# EAGLE design Schemtatic (EAGLE 9.3.0)
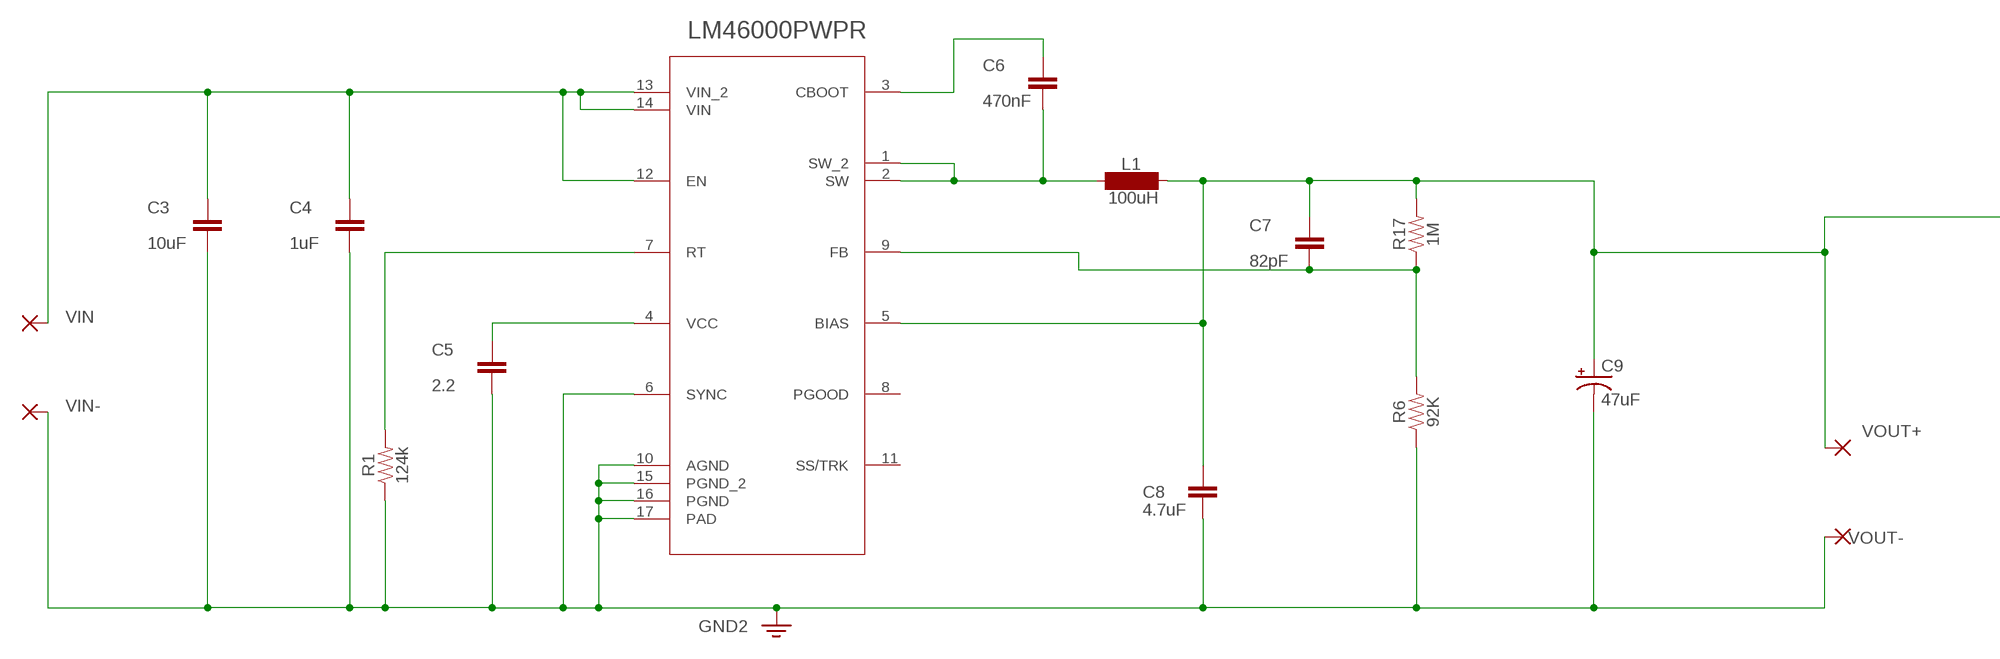
[diagram p0: schematic, sheet 1, part 1 of 2]
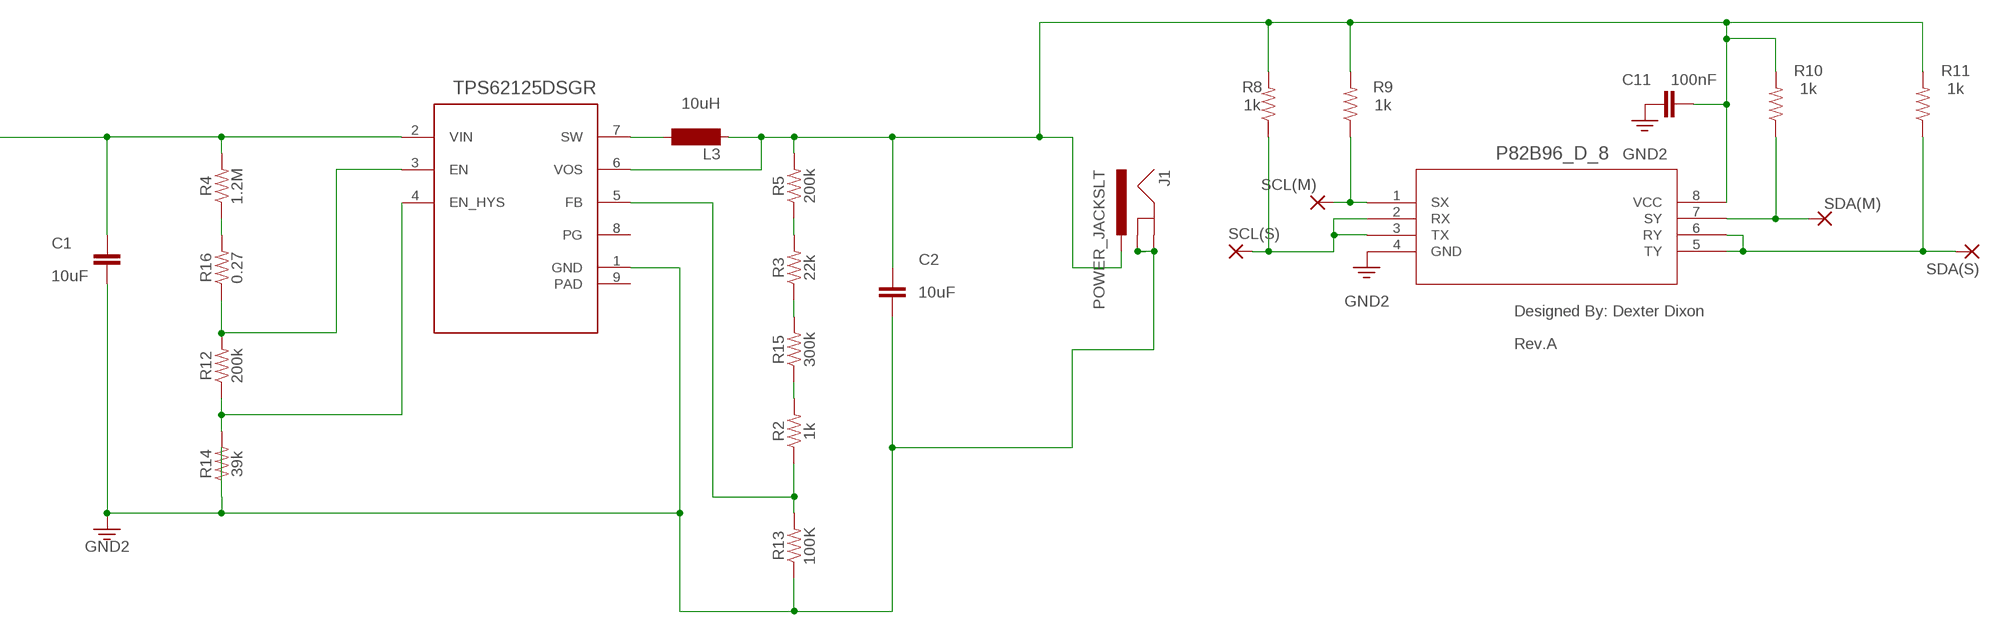
[diagram p1: schematic, sheet 1, part 2 of 2]

## Parts
C1  10uF  C2,5-3  [C2.5-3]
C2  10uF  C2,5-3  [C2.5-3]
C3  10uF  C2,5-3  [C2.5-3]
C4  1uF  C2,5-3  [C2.5-3]
C5  2.2  C2,5-3  [C2.5-3]
C6  470nF  C2,5-3  [C2.5-3]
C7  82pF  C2,5-3  [C2.5-3]
C8  4.7uF  C2,5-3  [C2.5-3]
C9  47uF  47UF-POLAR-EIA3528-10V-10%  [EIA3528]
C11  100nF  C2,5-3  [C2.5-3]
J1  POWER_JACKSLT  [POWER_JACK_SLOT]
L1  100uH  MS42  [MS42]
L3  10uH  MS42  [MS42]
R1  124k  100KOHM-0603-1/10W-1%  [0603]
R2  1k  1KOHM-0603-1/10W-1%  [0603]
R3  22k  22KOHM-0603-1/10W-1%  [0603]
R4  1.2M  1.2MOHM-0603-1/10W-1%  [0603]
R5  200k  200KOHM-0603-1/10W-1%  [0603]
R6  92K  100KOHM-0402-1/16W-1%  [0402]
R8  1k  1KOHM-0603-1/10W-1%  [0603]
R9  1k  1KOHM-0603-1/10W-1%  [0603]
R10  1k  1KOHM-0603-1/10W-1%  [0603]
R11  1k  1KOHM-0603-1/10W-1%  [0603]
R12  200k  200KOHM-0603-1/10W-1%  [0603]
R13  100K  100KOHM-0402-1/16W-1%  [0402]
R14  39k  39KOHM-0603-1/10W-1%  [0603]
R15  300k  300KOHM-0603-1/10W-1%  [0603]
R16  0.27  0.27OHM-0603-1/10W-1%  [0603]
R17  1M  1MOHM-0603-1/4W-5%  [0603]
SCL(M)  SMD5  [SMD2,54-5,08]
SCL(S)  SMD5  [SMD2,54-5,08]
SDA(M)  SMD5  [SMD2,54-5,08]
SDA(S)  SMD5  [SMD2,54-5,08]
TPS62125DSGR  Value  TPS62125DSGR  [DSG0008A]
U1  LM46000PWPR  [PWP0016F]
U2  P82B96_D_8  [D8]
VIN+  SMD5  [SMD2,54-5,08]
VIN-  SMD5  [SMD2,54-5,08]
VOUT+  SMD5  [SMD2,54-5,08]
VOUT-  SMD5  [SMD2,54-5,08]

## Nets
3.3V: C1.2 C2.2 C3.2 C4.2 C5.2 C8.2 C9.C(-) C11.1 J1.GND@1(GNDBREAK) J1.GND@2(GND) R1.1 R6.1 R13.1 R14.1 TPS62125DSGR.1(GND) U1.6(SYNC) U1.10(AGND) U1.15(PGND_2) U1.16(PGND) U1.17(PAD) U2.4(GND) VIN-.1(P) VOUT-.1(P) ; supply symbol labelled GND2
N$1: R8.1 SCL(S).1(P) U2.2(RX) U2.3(TX)
N$2: R11.1 SDA(S).1(P) U2.5(TY) U2.6(RY)
N$3: L3.2 TPS62125DSGR.7(SW)
N$4: R12.1 R14.2 TPS62125DSGR.4(EN_HYS)
N$5: R12.2 R16.1 TPS62125DSGR.3(EN)
N$6: C2.1 C11.2 J1.PWR L3.1 R5.2 R8.2 R9.2 R10.2 R11.2 TPS62125DSGR.6(VOS) U2.8(VCC)
N$7: C5.1 U1.4(VCC)
N$8: R3.2 R5.1
N$9: R4.1 R16.2
N$10: R9.1 SCL(M).1(P) U2.1(SX)
N$11: R10.1 SDA(M).1(P) U2.7(SY)
N$12: C6.2 L1.2 U1.1(SW_2) U1.2(SW)
N$13: C6.1 U1.3(CBOOT)
N$14: C7.2 R6.2 R17.1 U1.9(FB)
N$15: R2.1 R13.2 TPS62125DSGR.5(FB)
N$16: C1.1 C7.1 C8.1 C9.A(+) L1.1 R4.2 R17.2 TPS62125DSGR.2(VIN) U1.5(BIAS) VOUT+.1(P)
N$17: R3.1 R15.2
N$18: R2.2 R15.1
N$19: R1.2 U1.7(RT)
VIN+: C3.1 C4.1 U1.12(EN) U1.13(VIN_2) U1.14(VIN) VIN+.1(P)
Unconnected: TPS62125DSGR.8(PG) U1.8(PGOOD) U1.11(SS/TRK)

## Notes on the sheet
- Designed By: Dexter Dixon
- Rev.A

## Power pins joined to a net without a drawn wire
PAD: TPS62125DSGR.9(PAD)

## Library data of the parts
C1-C8 C11 = capacitor-wima:C: CAPACITOR naming: grid - package width
C9 = SparkFun-Capacitors:47UF-POLAR: 47µF polarized capacitors A capacitor is a passive two-terminal electrical component used to store electrical energy temporarily in an electric field.; PROD_ID: CAP-08310
J1 = SparkFun-Connectors:POWER_JACK: Power Jack Connector This is the standard 5.5mm barrel jack for power. The PTH is the most common, proven, reliable, footprint. The Slot footprint only works if the mill layer is transmitted to the PCB fab house so be warned. Here are the connectors we sell at SparkFun: DC Barrel Power Jack/Connector <https://www.sparkfun.com/products/119> (PRT-00119) DC Barrel Power Jack/Connector (SMD) <https://www.sparkfun.com/products/12748> (PRT-12748) DC Barrel Jack Adapter - Breadboard Compatible <https://www.sparkfun.com/products/10811> (PRT-10811) It is used on this SparkFun product (and many, many others): SparkFun RedBoard - Programmed with Arduino <https://www.sparkfun.com/products/12757> (DEV-12757) Also, if you need a mating power supply or connector, please check these out: Wall Adapter Power Supply - 9VDC 650mA <https://www.sparkfun.com/products/298> (TOL-00298) DC Barrel Jack Adapter - Male <https://www.sparkfun.com/products/10287> (PRT-10287); PROD_ID: PRT-00119
L1 = inductor-neosid:MS42: INDUCTOR SMD inductor; L: 100uH; OC_FARNELL: unknown; OC_NEWARK: unknown
L3 = inductor-neosid:MS42: INDUCTOR SMD inductor; L: 10uH; OC_FARNELL: unknown; OC_NEWARK: unknown
R1 = SparkFun-Resistors:100KOHM: 100kΩ resistor A resistor is a passive two-terminal electrical component that implements electrical resistance as a circuit element. Resistors act to reduce current flow, and, at the same time, act to lower voltage levels within circuits. - Wikipedia; PROD_ID: RES-07828; VALUE: 100k
R2 R8-R11 = SparkFun-Resistors:1KOHM: 1kΩ resistor A resistor is a passive two-terminal electrical component that implements electrical resistance as a circuit element. Resistors act to reduce current flow, and, at the same time, act to lower voltage levels within circuits. - Wikipedia; PROD_ID: RES-07856
R3 = SparkFun-Resistors:22KOHM: 22kΩ resistor A resistor is a passive two-terminal electrical component that implements electrical resistance as a circuit element. Resistors act to reduce current flow, and, at the same time, act to lower voltage levels within circuits. - Wikipedia; PROD_ID: RES-07853
R4 = SparkFun-Resistors:1.2MOHM: 1.2MΩ resistor A resistor is a passive two-terminal electrical component that implements electrical resistance as a circuit element. Resistors act to reduce current flow, and, at the same time, act to lower voltage levels within circuits. - Wikipedia; PROD_ID: RES-10055
R5 R12 = SparkFun-Resistors:200KOHM: 200kΩ resistor A resistor is a passive two-terminal electrical component that implements electrical resistance as a circuit element. Resistors act to reduce current flow, and, at the same time, act to lower voltage levels within circuits. - Wikipedia; PROD_ID: RES-09385
R6 = SparkFun-Resistors:100KOHM: 100kΩ resistor A resistor is a passive two-terminal electrical component that implements electrical resistance as a circuit element. Resistors act to reduce current flow, and, at the same time, act to lower voltage levels within circuits. - Wikipedia; PROD_ID: RES-13495; VALUE: 100K
R13 = SparkFun-Resistors:100KOHM: 100kΩ resistor A resistor is a passive two-terminal electrical component that implements electrical resistance as a circuit element. Resistors act to reduce current flow, and, at the same time, act to lower voltage levels within circuits. - Wikipedia; PROD_ID: RES-13495
R14 = SparkFun-Resistors:39KOHM: 39kΩ resistor A resistor is a passive two-terminal electrical component that implements electrical resistance as a circuit element. Resistors act to reduce current flow, and, at the same time, act to lower voltage levels within circuits. - Wikipedia; PROD_ID: RES-12377
R15 = SparkFun-Resistors:300KOHM: 300kΩ resistor A resistor is a passive two-terminal electrical component that implements electrical resistance as a circuit element. Resistors act to reduce current flow, and, at the same time, act to lower voltage levels within circuits. - Wikipedia; PROD_ID: RES-10809
R16 = SparkFun-Resistors:0.27OHM: 0.27Ω resistor A resistor is a passive two-terminal electrical component that implements electrical resistance as a circuit element. Resistors act to reduce current flow, and, at the same time, act to lower voltage levels within circuits. - Wikipedia; PROD_ID: RES-08787
R17 = SparkFun-Resistors:1MOHM: 1MΩ resistor A resistor is a passive two-terminal electrical component that implements electrical resistance as a circuit element. Resistors act to reduce current flow, and, at the same time, act to lower voltage levels within circuits. - Wikipedia; PROD_ID: RES-07868
SCL(M) SCL(S) SDA(M) SDA(S) VOUT+ VOUT- = wirepad:SMD5: SMD PAD
TPS62125DSGR = TPS62125:TPS62125DSGR; ALTERNATEPARTNUMBER: TPS62125DSGT; COMPTYPE: IC; MANUFACTURER: Texas Instruments; MOUNTTYPE: SMT; PACKAGEREFERENCE: DSG0008A; PARTNUMBER: TPS62125DSGR; PIN_COUNT: 9; REFDES: RefDes; ROHS: Y; TYPE: TYPE
U1 = LM46000:LM46000PWPR; ADDRESS1: Not shown in title block; ADDRESS2: Not shown in title block; ADDRESS3: Not shown in title block; ADDRESS4: Not shown in title block; ALTERNATEMANUFACTURER: None; APPROVEDBY: Not shown in title block; AUTHOR: Not shown in title block; CHECKEDBY: Not shown in title block; COMPANYNAME: Not shown in title block; COMPONENTLINK1DESCRIPTION: Datasheet Link; COMPONENTLINK1URL: NA; COMPTYPE: IC; CURRENTDATE: Not shown in title block; CURRENTTIME: Not shown in title block; DATE: Not shown in title block; DESIGNATOR: U?; DOCUMENTFULLPATHANDNAME: Not shown in title block; DOCUMENTNAME: Not shown in title block; DOCUMENTNUMBER: 1; ENGINEER: Not shown in title block; IMAGEPATH: Not shown in title block; LATESTREVISIONDATE: 20140220; MANUFACTURER: Texas Instruments; MODIFIEDDATE: Not shown in title block; MOUNTTYPE: SMT; ORGANIZATION: Not shown in title block; PACKAGEREFERENCE: PWP0016F; PARTNUMBER: LM46000PWP; PIN_COUNT: 17; PROJECTNAME: *; PUBLISHER: Texas Instruments; REVISION: Use project parameter SCH_Rev; ROHS: Y; RULE: *; SHEETNUMBER: 1; SHEETTOTAL: 1; SYMBOLCREATOR: x0208326; SYMBOLVERSION: 20140214; TIME: Not shown in title block; UM: EA
U2 = BusBuffer:P82B96_D_8; DATASHEETURL: httpwww.ti.comlitgpnP82B96; FAMILY_NAME: I2C HUB BUFFER REPEATER; GENERIC_PART_NUMBER: P82B96; INDUSTRY_STD_PKG_TYPE: SOIC; MANUFACTURER: Texas Instruments; MANUFACTURER_PART_NUMBER: p82b96_d_8; PACKAGE_DESIGNATOR: D; PIN_COUNT: 8; VENDOR: Texas Instruments
VIN+ = wirepad:SMD5: SMD PAD; VIN: 48V
VIN- = wirepad:SMD5: SMD PAD; VIN-: GND

## Net classes
0 default: width 0.152 mm, clearance 0.203 mm

## Board
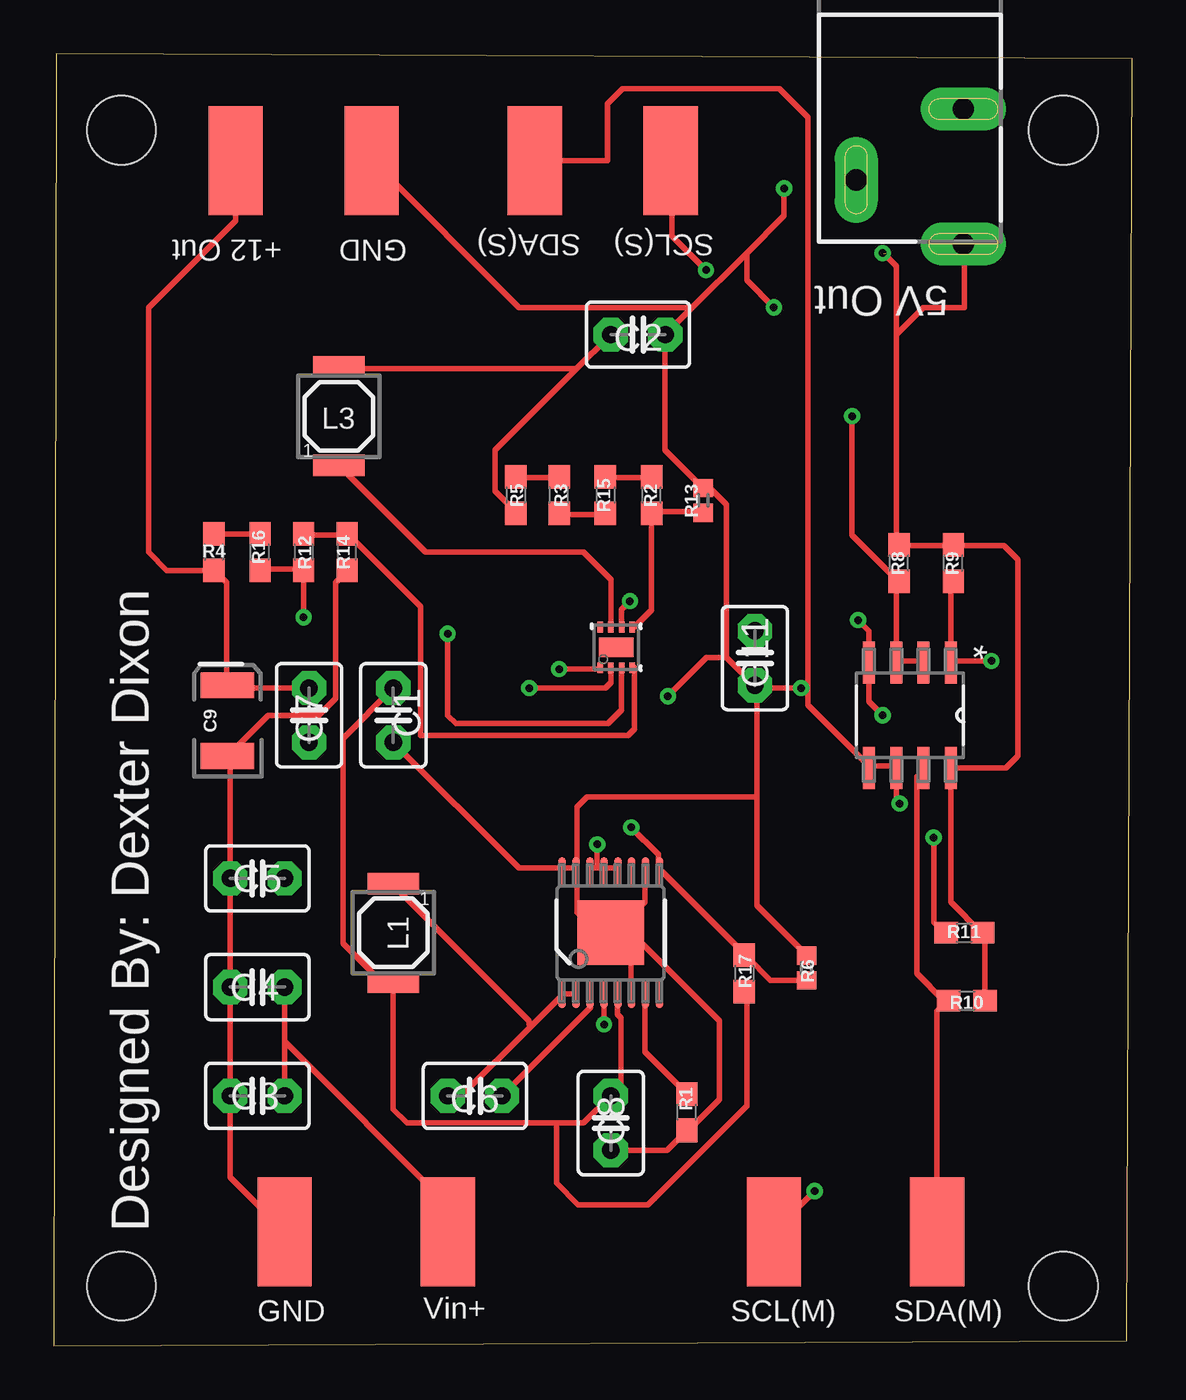
[diagram p2: board, top side]
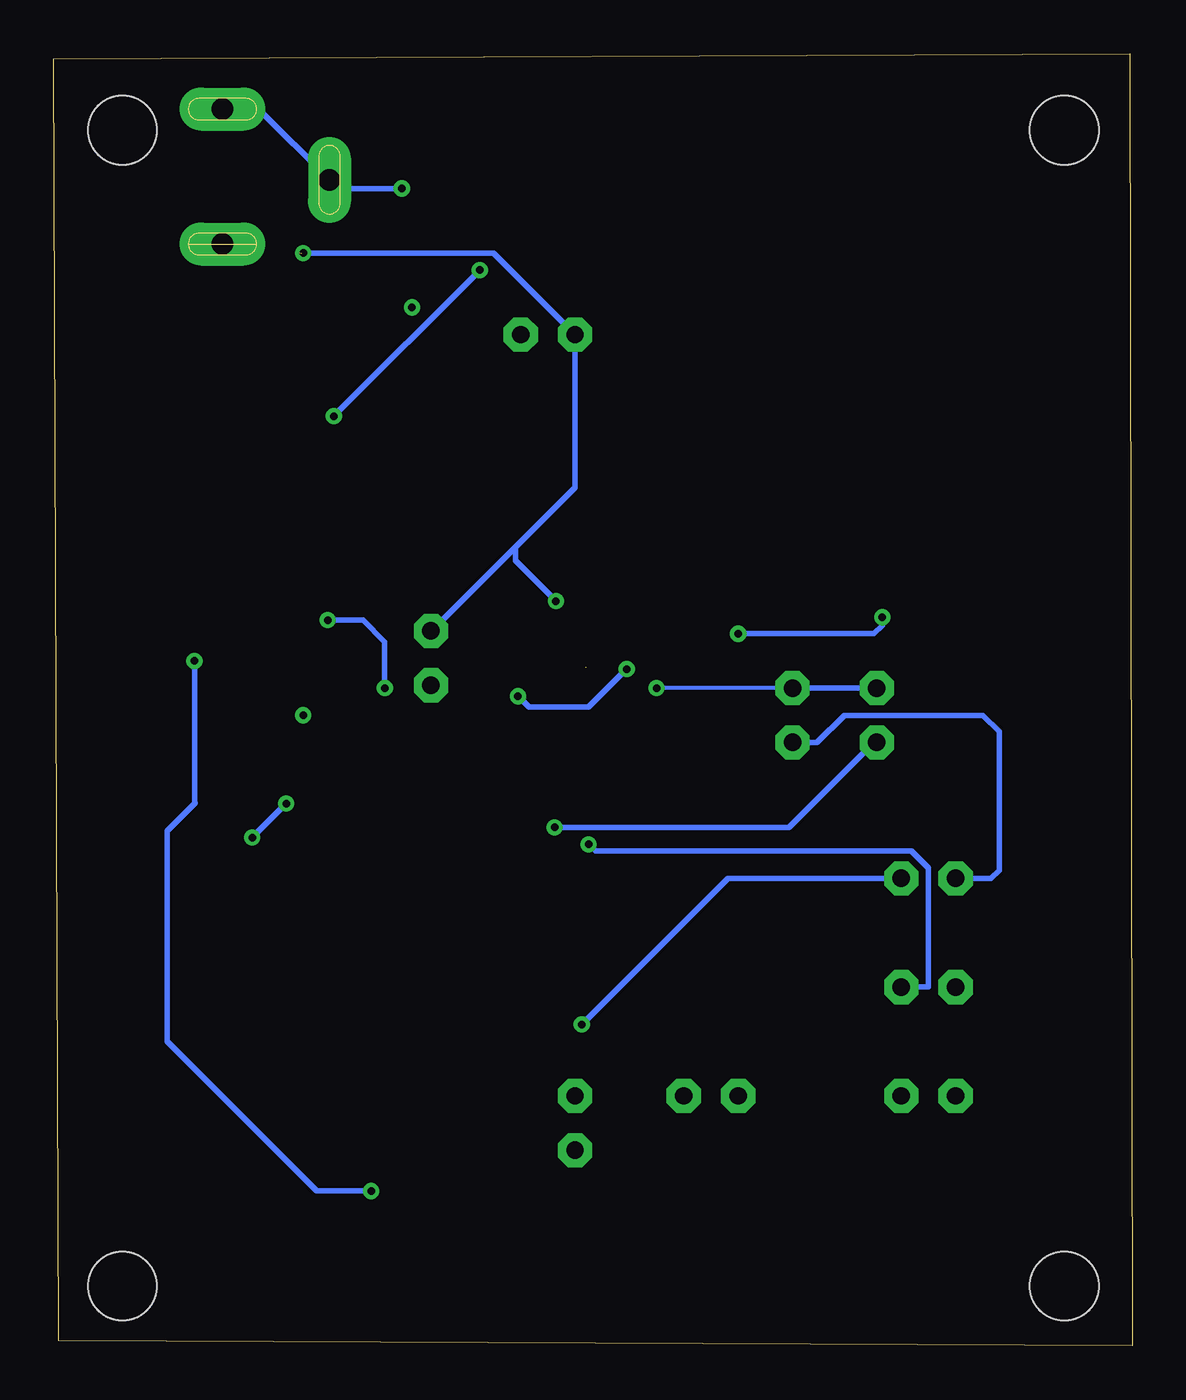
[diagram p3: board, bottom side, seen from below]

Size 50.4 x 60.38 mm. Coordinates in mm from the lower left corner, seen from the top.
Outline: 0,0 50.14,0.25 50.4,60.12 0.13,60.38 0,0
Copper layers (1*16): Top 0.035mm / dielectric 1.5mm / Bottom 0.035mm
Design rules "default *": minimum track width 7mil, minimum drill 0.35mm, track to track 10mil, track to pad 10mil, pad to pad 10mil, via to via 10mil, smd to smd 6mil, copper to edge 40mil, drill to drill 6mil, minimum pad ring 10mil, minimum via ring 8mil, stop-mask expansion 4mil, vias tented up to drill 0mil, thermal gap 10mil
Holes 3.2 mm at 3.17,56.79 3.17,2.79 47.17,2.79 47.17,56.79

### Footprints (pad centres in the part's own frame; a part is rotated, then mirrored left to right if it is on the bottom)
C2.5-3 = drill 0.813 pad 1.6 octagon: 1 -1.27,0; 2 1.27,0
EIA3528 = smd 1.2 x 2.5: A 1.65,0; C -1.65,0
POWER_JACK_SLOT = drill 1 pad 2 long: GND@1 2.58,7.5; GND@2 7.58,10.8; PWR 2.58,13.8
MS42 = smd 2.4 x 1: 1 0,2.3; 2 0,-2.3
0603 = smd 1.1 x 1: 1 -0.85,0; 2 0.85,0
0402 = smd 0.85 x 0.9: 1 -0.58,0; 2 0.58,0
SMD2,54-5,08 = smd 2.54 x 5.08: 1 0,0
DSG0008A = smd 0.5 x 0.25: 1 -0.95,0.75; 2 -0.95,0.25; 3 -0.95,-0.25; 4 -0.95,-0.75; 5 0.95,-0.75; 6 0.95,-0.25; 7 0.95,0.25; 8 0.95,0.75 | smd 0.9 x 1.6: 9 0,0 | smd 0.5 x 0.5: V 0,-0.4
PWP0016F = smd 1.3 x 0.35: 1 -2.875,2.275; 2 -2.875,1.625; 3 -2.875,0.975; 4 -2.875,0.325; 5 -2.875,-0.325; 6 -2.875,-0.975; 7 -2.875,-1.625; 8 -2.875,-2.275; 9 2.875,-2.275; 10 2.875,-1.625; 11 2.875,-0.975; 12 2.875,-0.325; 13 2.875,0.325; 14 2.875,0.975; 15 2.875,1.625; 16 2.875,2.275 | smd 3 x 3.1: 17 0,0 | smd 0.4 x 0.4: V -1,0
D8 = smd 1.981 x 0.559: 1 -2.464,1.905; 2 -2.464,0.635; 3 -2.464,-0.635; 4 -2.464,-1.905; 5 2.464,-1.905; 6 2.464,-0.635; 7 2.464,0.635; 8 2.464,1.905

### Placement (x,y rotation side)
C1  15.88,29.46 270 top
C2  27.3,47.24 0 top
C3  9.52,11.68 180 top
C4  9.52,16.76 180 top
C5  9.52,21.84 180 top
C6  19.69,11.68 180 top
C7  11.94,29.46 270 top
C8  26.04,10.41 270 top
C9  8.13,29.21 90 top
C11  32.77,32.13 90 top
J1  45.08,65.28 180 top
L1  15.88,19.3 180 top
L3  13.34,43.43 0 top
R1  29.59,10.92 90 top
R2  27.94,39.75 90 top
R3  23.62,39.75 90 top
R4  7.49,37.08 270 top
R5  21.59,39.75 270 top
R6  35.18,17.65 270 top
R8  39.5,36.58 90 top
R9  42.04,36.58 90 top
R10  42.67,16.13 0 top
R11  42.54,19.3 0 top
R12  11.68,37.08 270 top
R13  30.35,39.5 270 top
R14  13.72,37.08 90 top
R15  25.78,39.75 270 top
R16  9.65,37.08 90 top
R17  32.26,17.4 270 top
SCL(M)  33.66,5.33 0 top
SCL(S)  28.83,55.37 180 top
SDA(M)  41.27,5.33 0 top
SDA(S)  22.48,55.37 180 top
TPS62125DSGR  26.29,32.64 90 top
U1  26.04,19.3 90 top
U2  40,29.46 270 top
VIN+  18.41,5.33 0 top
VIN-  10.79,5.33 0 top
VOUT+  8.51,55.37 0 top
VOUT-  14.86,55.37 0 top

### Tracks (layer width: path | path; a pad name or v marks a point on that pad's centre or on a via)
3.3V  (via drill 0.35, 0.35 pad 0.4)  (1 unrouted)
  Top 0.254: 30.32,40.1 28.57,41.85 C2.2 29.77,48.43 | 30.32,40.1 R13.1 30.48,39.94 | 32.38,51.05 34.13,52.8 v34.13,54.07 | 32.38,51.05 29.77,48.43 | VOUT-.1 14.92,55.34 21.75,48.51 29.69,48.51 29.77,48.43 | R14.1 13.65,36.13 13.18,35.65 13.18,30.26 12.38,29.46 10.03,29.46 C9.C | 8.51,28.03 C9.C | VIN-.1 8.25,7.87 C3.2 C4.2 C5.2 8.25,27.56 C9.C | 32.86,30.73 32.86,25.65 | 32.86,25.65 32.86,20.57 35.08,18.35 R6.1 | 32.86,30.73 C11.1 32.7,30.89 31.43,32.16 | 38.1,31.84 U2.4 | 29.53,9.94 R1.1 | U1.15 24.29,22.32 23.81,22.32 U1.16 23.65,22.32 21.75,22.32 C1.2 | U1.17 26.99,18.35 26.99,16.45 U1.6 | U1.10 27.62,22.16 27.62,20.73 26.19,19.3 U1.17 | U1.17 25.4,19.3 24.45,20.26 24.45,22.16 U1.15 | R1.1 29.69,10.1 31.12,11.53 31.12,15.18 26.67,19.62 U1.17 | U1.15 24.45,22.32 24.45,25.18 24.92,25.65 32.86,25.65 | 31.43,32.16 31.43,39.31 30.64,40.1 30.32,40.1 | 31.43,32.16 30.51,32.16 v28.7,30.35 | U2.4 38.1,33.4 v37.59,33.91 | v34.92,30.73 32.86,30.73 | R1.1 28.66,9.14 C8.2 | TPS62125DSGR.1 25.53,31.62 v23.62,31.62 | 32.38,51.05 32.38,49.78 v33.66,48.51 | U2.4 38.1,30.1 v38.73,29.46
  Bottom 0.254: 32.86,30.73 C11.1 | C1.2 14.73,28.19 13.46,29.46 6.98,29.46 6.22,28.7 6.22,22.23 6.6,21.84 C5.2 | v28.7,30.35 28.19,29.84 25.4,29.84 v23.62,31.62 | v37.59,33.91 35.94,33.91 34.92,32.89 v34.92,30.73 | v34.13,54.07 37.1,54.07 J1.GND@2 40.8,57.78 J1.GND@1
N$1  (via drill 0.35)
  Top 0.254: 39.37,32 39.37,35.65 R8.1 39.37,35.81 37.31,37.88 v37.31,43.43 | 39.37,32 40.64,32 U2.2 | 39.37,32 U2.3 | v30.48,50.26 28.89,51.85 28.89,55.34 SCL(S).1
  Bottom 0.254: v30.48,50.26 v37.31,43.43
N$2  (via drill 0.35)
  Top 0.254: v41.12,23.75 41.12,19.78 41.59,19.3 R11.1 | v39.53,25.34 39.37,25.5 U2.6 39.37,27.08 38.1,27.08 | 38.1,27.08 35.24,29.94 35.24,57.4 33.91,58.74 26.57,58.74 25.88,58.04 25.88,55.37 SDA(S).1 22.54,55.5 | 38.1,27.08 U2.5
  Bottom 0.254: v39.53,25.34 v41.12,23.75
N$3
  Top 0.254: TPS62125DSGR.7 26.04,35.81 24.77,37.08 17.39,37.08 L3.2
N$4
  Top 0.254: TPS62125DSGR.4 27.15,31.69 27.15,28.83 26.83,28.51 17.14,28.51 17.14,34.54 13.81,37.88 R14.2 13.65,37.88 11.75,37.88 R12.1
N$5  (via drill 0.35)
  Top 0.254: R16.1 9.68,36.29 11.59,36.29 R12.2 v11.68,34.04 | TPS62125DSGR.3 26.54,29.71 25.91,29.08 18.8,29.08 18.41,29.46 v18.41,33.27
  Bottom 0.254: v18.41,33.27 12.07,33.27 11.68,33.66 v11.68,34.04
N$6  (via drill 0.35)  (1 unrouted)
  Top 0.254: C2.1 24.37,45.58 | 24.37,45.58 20.64,41.85 20.64,39.94 21.59,38.99 R5.2 | L3.1 13.34,45.66 24.29,45.66 24.37,45.58 | R10.2 43.5,16.13 43.5,19.3 R11.2 43.34,19.3 41.91,20.73 U2.8 44.49,27 45.05,27.56 45.05,36.73 44.39,37.4 41.91,37.4 | 41.91,37.4 39.53,37.4 R8.2 39.37,37.56 39.37,47.24 | 41.91,37.4 R9.2 | 38.8,51.02 39.37,50.45 39.37,47.24 | TPS62125DSGR.6 26.54,34.41 v26.92,34.8 | 39.37,47.24 40.64,48.51 42.54,48.51 42.54,51.44 J1.PWR
  Bottom 0.254: 28.81,37.32 26.04,40.1 C2.1 29.85,51.05 v38.73,51.05 38.89,51.05 | 28.81,37.32 32.7,33.43 C11.2 | v26.92,34.8 28.81,36.69 28.81,37.32
N$7  (via drill 0.35)
  Top 0.254: v25.72,15.02 25.72,16.29 U1.4
  Bottom 0.254: v25.72,15.02 18.89,21.84 C5.1
N$8
  Top 0.254: R5.1 21.59,40.58 23.5,40.58 R3.2
N$9
  Top 0.254: R4.1 R16.2
N$10  (via drill 0.35, 0.35 pad 0.4)
  Top 0.254: 41.91,32 U2.1 41.91,31.84 | 41.91,32 41.91,35.65 R9.1 | SCL(M).1 v35.56,7.24 | v43.81,32 41.91,32
  Bottom 0.254: v35.56,7.24 38.1,7.24 45.08,14.22 45.08,24.07 43.78,25.37 43.81,25.4 v43.81,32
N$11
  Top 0.254: SDA(M).1 41.27,15.65 41.75,16.13 R10.1 41.59,16.13 40.32,17.4 40.32,26.61 40.64,26.92 U2.7
N$12
  Top 0.254: U1.2 24.29,16.45 23.81,16.45 U1.1 23.65,16.29 22.3,14.94 | 22.3,14.94 19.05,11.68 C6.2 | L1.2 15.88,21.53 22.23,15.18 22.23,15.02 22.3,14.94
N$13
  Top 0.254: C6.1 25.08,15.81 25.08,16.29 U1.3
N$14  (via drill 0.35)
  Top 0.254: R6.2 35.08,17.08 33.5,17.08 32.38,18.19 R17.1 32.23,18.35 28.42,22.16 U1.9 28.26,22.32 28.26,22.96 v26.99,24.23
  Bottom 0.254: v26.99,24.23 16.03,24.23 12.07,28.19 C7.2
N$15
  Top 0.254: TPS62125DSGR.5 27.15,33.59 27.94,34.38 R2.1 27.94,38.99 30.32,38.99 R13.2
N$16  (via drill 0.35 pad 0.4)
  Top 0.178: TPS62125DSGR.2
  Top 0.254: R4.2 7.62,36.13 8.1,35.65 8.1,30.89 C9.A 8.25,30.73 C7.1 | 8.41,55.34 VOUT+.1 8.51,52.58 4.45,48.51 4.45,37.08 5.29,36.23 R4.2 | 7.62,36.29 R4.2 | 23.5,10.41 23.5,7.62 24.51,6.6 27.78,6.6 32.38,11.21 32.38,16.42 R17.2 | U1.5 26.35,16.29 26.35,15.49 26.51,15.34 26.51,12.16 C8.1 24.77,10.41 23.5,10.41 | C1.1 13.53,28.38 13.53,18.8 15.32,17 L1.1 15.88,11.05 16.51,10.41 23.5,10.41 | TPS62125DSGR.2 26.04,30.99 25.78,30.73 v22.23,30.73
  Bottom 0.178: C1.1 v22.23,30.73
  Bottom 0.254: C1.1 C7.1
N$17
  Top 0.254: R3.1 23.65,38.83 25.72,38.83 R15.2
N$18
  Top 0.254: R15.1 25.88,40.58 27.94,40.58 R2.2
N$19
  Top 0.254: R1.2 29.53,11.84 27.62,13.75 27.62,16.29 U1.7
VIN+  (via drill 0.35)
  Top 0.254: 25.4,22.32 25.56,22.32 U1.13 25.72,22.32 26.35,22.32 U1.12 | 25.4,22.32 25.08,22.32 U1.14 | v25.4,23.43 25.4,22.32 | C4.1 10.79,14.22 | VIN+.1 18.41,6.6 10.79,14.22 | 10.79,14.22 C3.1
  Bottom 0.254: v25.4,23.43 25.08,23.11 10.32,23.11 9.52,22.32 9.52,16.76 C4.1

### Text on the board
tPlace: +12 Out | GND | SDA(S) | SCL(S) | 5V Out | Designed By: Dexter Dixon | GND | Vin+ | SCL(M) | SDA(M)